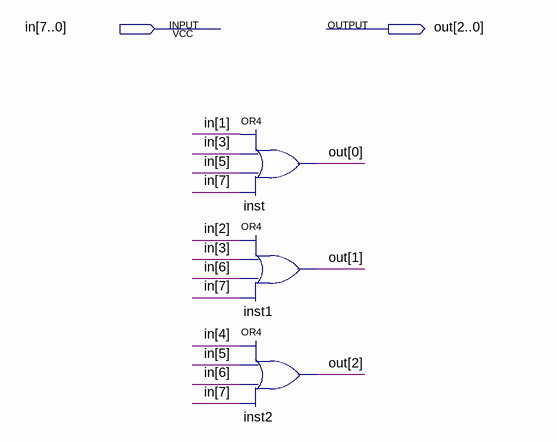
[diagram p0: schematic sheet]
// Quartus schematic Encoder_8x3.bdf as structural Verilog: 3 symbols, 2 pins
module Encoder_8x3 (
  input  [7:0] in,
  output [2:0] out
);

  or inst (out[0], in[1], in[3], in[5], in[7]);
  or inst1 (out[1], in[2], in[3], in[6], in[7]);
  or inst2 (out[2], in[4], in[5], in[6], in[7]);
endmodule
